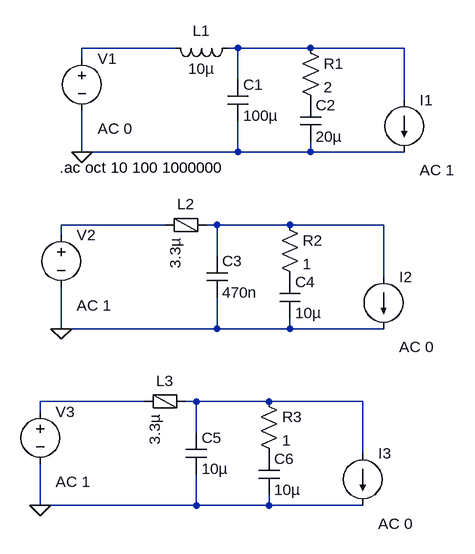
[diagram p0: schematic pwr_filtering.asc]
pwr_filtering.asc, the LTspice schematic file:
Version 4
SHEET 1 880 892
WIRE 240 144 96 144
WIRE 336 144 320 144
WIRE 448 144 336 144
WIRE 592 144 448 144
WIRE 96 160 96 144
WIRE 336 192 336 144
WIRE 592 224 592 144
WIRE 96 304 96 240
WIRE 336 304 336 256
WIRE 336 304 96 304
WIRE 448 304 448 288
WIRE 448 304 336 304
WIRE 592 304 448 304
WIRE 224 416 64 416
WIRE 304 416 288 416
WIRE 416 416 304 416
WIRE 560 416 416 416
WIRE 64 432 64 416
WIRE 304 464 304 416
WIRE 560 496 560 416
WIRE 64 576 64 512
WIRE 304 576 304 528
WIRE 304 576 64 576
WIRE 416 576 416 560
WIRE 416 576 304 576
WIRE 560 576 416 576
WIRE 192 688 32 688
WIRE 272 688 256 688
WIRE 384 688 272 688
WIRE 528 688 384 688
WIRE 32 704 32 688
WIRE 272 736 272 688
WIRE 528 768 528 688
WIRE 32 848 32 784
WIRE 272 848 272 800
WIRE 272 848 32 848
WIRE 384 848 384 832
WIRE 384 848 272 848
WIRE 528 848 384 848
FLAG 96 304 0
FLAG 64 576 0
FLAG 32 848 0
SYMBOL voltage 96 144 R0
WINDOW 123 24 124 Left 2
WINDOW 39 0 0 Left 2
SYMATTR InstName V1
SYMATTR Value ""
SYMATTR Value2 AC 0
SYMBOL cap 320 192 R0
SYMATTR InstName C1
SYMATTR Value 100µ
SYMBOL ind 336 128 R90
WINDOW 0 5 56 VBottom 2
WINDOW 3 32 56 VTop 2
SYMATTR InstName L1
SYMATTR Value 10µ
SYMBOL res 432 128 R0
SYMATTR InstName R1
SYMATTR Value 2
SYMBOL cap 432 224 R0
SYMATTR InstName C2
SYMATTR Value 20µ
SYMBOL current 592 224 R0
WINDOW 123 24 108 Left 2
WINDOW 39 0 0 Left 2
SYMATTR InstName I1
SYMATTR Value ""
SYMATTR Value2 AC 1
SYMBOL voltage 64 416 R0
WINDOW 123 24 124 Left 2
WINDOW 39 0 0 Left 2
SYMATTR InstName V2
SYMATTR Value ""
SYMATTR Value2 AC 1
SYMBOL cap 288 464 R0
SYMATTR InstName C3
SYMATTR Value 470n
SYMBOL res 400 400 R0
SYMATTR InstName R2
SYMATTR Value 1
SYMBOL cap 400 496 R0
SYMATTR InstName C4
SYMATTR Value 10µ
SYMBOL current 560 496 R0
WINDOW 123 24 108 Left 2
WINDOW 39 0 0 Left 2
SYMATTR InstName I2
SYMATTR Value ""
SYMATTR Value2 AC 0
SYMBOL FerriteBead 256 416 R90
WINDOW 0 -16 0 VBottom 2
SYMATTR InstName L2
SYMATTR Value 3.3µ
SYMATTR SpiceLine Ipk=0.6 Rser=0.23 Rpar=1050 Cpar=680f mfg="Wurth Elektronik" pn="742 792 662"
SYMBOL voltage 32 688 R0
WINDOW 123 24 124 Left 2
WINDOW 39 0 0 Left 2
SYMATTR InstName V3
SYMATTR Value ""
SYMATTR Value2 AC 1
SYMBOL cap 256 736 R0
SYMATTR InstName C5
SYMATTR Value 10µ
SYMBOL res 368 672 R0
SYMATTR InstName R3
SYMATTR Value 1
SYMBOL cap 368 768 R0
SYMATTR InstName C6
SYMATTR Value 10µ
SYMBOL current 528 768 R0
WINDOW 123 24 108 Left 2
WINDOW 39 0 0 Left 2
SYMATTR InstName I3
SYMATTR Value ""
SYMATTR Value2 AC 0
SYMBOL FerriteBead 224 688 R90
WINDOW 0 -16 0 VBottom 2
SYMATTR InstName L3
SYMATTR Value 3.3µ
SYMATTR SpiceLine Ipk=0.6 Rser=0.23 Rpar=1050 Cpar=680f mfg="Wurth Elektronik" pn="742 792 662"
TEXT 62 328 Left 2 !.ac oct 10 100 1000000

The netlist it stands for:
* pwr_filtering.asc
V1 N001 0 AC 0
C1 N002 0 100µ
L1 N002 N001 10µ
R1 N002 P001 2
C2 P001 0 20µ
I1 N002 0 AC 1
V2 N003 0 AC 1
C3 N004 0 470n
R2 N004 P002 1
C4 P002 0 10µ
I2 N004 0 AC 0
L2 N004 N003 3.3µ Ipk=0.6 Rser=0.23 Rpar=1050 Cpar=680f mfg="Wurth Elektronik" pn="742 792 662"
V3 N005 0 AC 1
C5 N006 0 10µ
R3 N006 P003 1
C6 P003 0 10µ
I3 N006 0 AC 0
L3 N006 N005 3.3µ Ipk=0.6 Rser=0.23 Rpar=1050 Cpar=680f mfg="Wurth Elektronik" pn="742 792 662"
.ac oct 10 100 1000000
.backanno
.end